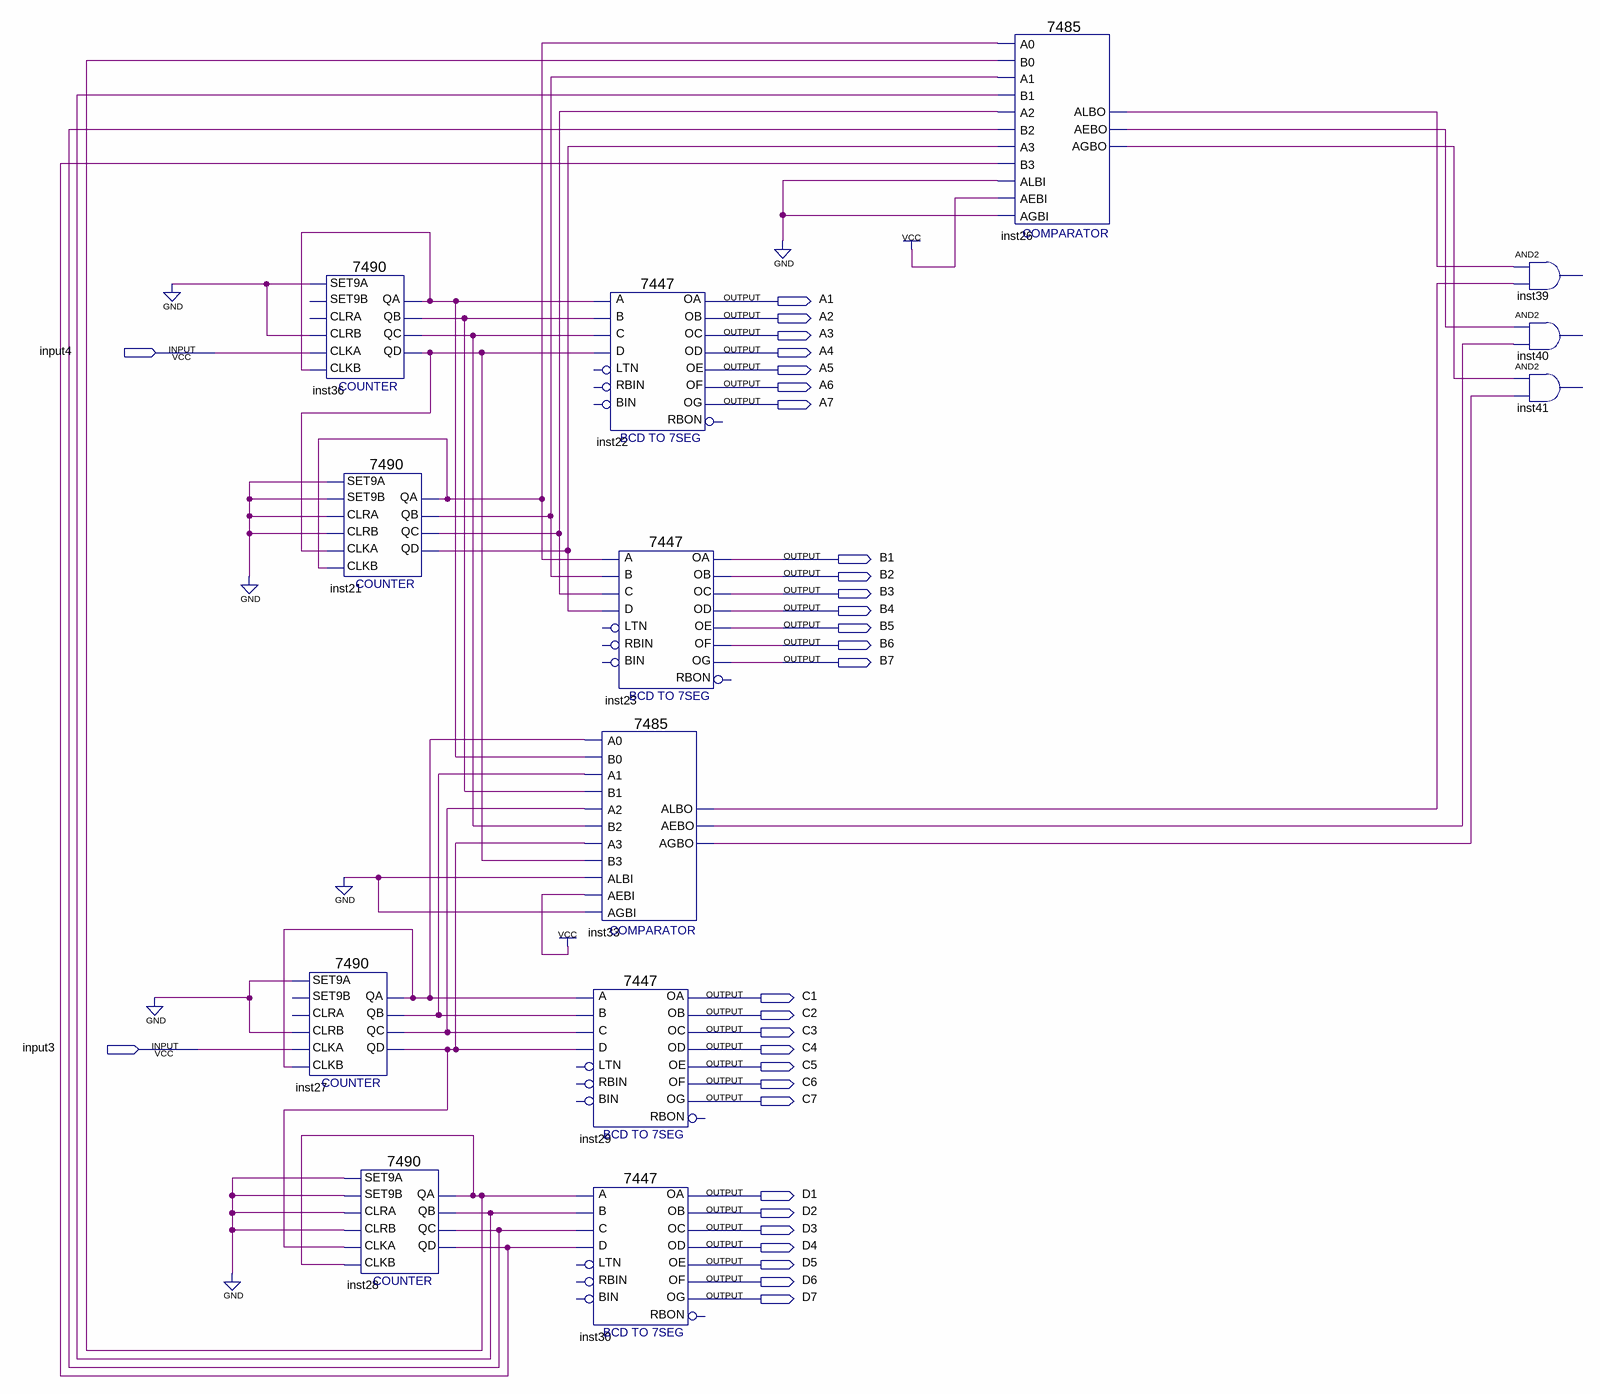
[diagram p0: schematic sheet]
// Quartus schematic prueba2.bdf as structural Verilog: 13 symbols, 30 pins
module prueba2 (
  input  input4,
  input  input3,
  output A1,
  output A2,
  output A3,
  output A4,
  output A5,
  output A6,
  output A7,
  output B1,
  output B2,
  output B3,
  output B4,
  output B5,
  output B6,
  output B7,
  output C1,
  output C2,
  output C3,
  output C4,
  output C5,
  output C6,
  output C7,
  output D1,
  output D2,
  output D3,
  output D4,
  output D5,
  output D6,
  output D7
);

  wire inst21_qa, inst21_qb, inst21_qc, inst21_qd, inst26_aebo, inst26_agbo, inst26_albo, inst27_qa,
       inst27_qb, inst27_qc, inst27_qd, inst28_qa, inst28_qb, inst28_qc, inst28_qd, inst33_aebo, inst33_agbo,
       inst33_albo, inst36_qa, inst36_qb, inst36_qc, inst36_qd;

  \7490  inst27 (
    .SET9A(1'b0), .CLKB(inst27_qa), .CLKA(input3), .CLRB(1'b0), .QD(inst27_qd), .QA(inst27_qa),
    .QB(inst27_qb), .QC(inst27_qc));  // open: CLRA, SET9B
  \7490  inst36 (
    .SET9A(1'b0), .CLKB(inst36_qa), .CLKA(input4), .CLRB(1'b0), .QD(inst36_qd), .QA(inst36_qa),
    .QB(inst36_qb), .QC(inst36_qc));  // open: CLRA, SET9B
  \7490  inst21 (
    .SET9A(1'b0), .CLRA(1'b0), .SET9B(1'b0), .CLKB(inst21_qa), .CLKA(inst36_qd), .CLRB(1'b0), .QD(inst21_qd),
    .QA(inst21_qa), .QB(inst21_qb), .QC(inst21_qc));
  \7490  inst28 (
    .SET9A(1'b0), .CLRA(1'b0), .SET9B(1'b0), .CLKB(inst28_qa), .CLKA(inst27_qd), .CLRB(1'b0), .QD(inst28_qd),
    .QA(inst28_qa), .QB(inst28_qb), .QC(inst28_qc));
  \7447  inst29 (
    .B(inst27_qb), .C(inst27_qc), .D(inst27_qd), .A(inst27_qa), .OB(C2), .OC(C3), .OE(C5), .OD(C4), .OF(C6),
    .OG(C7), .OA(C1));  // open: LTN, RBIN, BIN, RBON
  \7447  inst30 (
    .B(inst28_qb), .C(inst28_qc), .D(inst28_qd), .A(inst28_qa), .OB(D2), .OC(D3), .OE(D5), .OD(D4), .OF(D6),
    .OG(D7), .OA(D1));  // open: LTN, RBIN, BIN, RBON
  \7447  inst22 (
    .B(inst36_qb), .C(inst36_qc), .D(inst36_qd), .A(inst36_qa), .OB(A2), .OC(A3), .OE(A5), .OD(A4), .OF(A6),
    .OG(A7), .OA(A1));  // open: LTN, RBIN, BIN, RBON
  \7447  inst23 (
    .B(inst21_qb), .C(inst21_qc), .D(inst21_qd), .A(inst21_qa), .OB(B2), .OC(B3), .OE(B5), .OD(B4), .OF(B6),
    .OG(B7), .OA(B1));  // open: LTN, RBIN, BIN, RBON
  \7485  inst33 (
    .A3(inst27_qd), .B2(inst36_qc), .A2(inst27_qc), .AEBI(1'b1), .AGBI(1'b0), .ALBI(1'b0), .A0(inst27_qa),
    .B0(inst36_qa), .B3(inst36_qd), .A1(inst27_qb), .B1(inst36_qb), .ALBO(inst33_albo), .AGBO(inst33_agbo),
    .AEBO(inst33_aebo));
  \7485  inst26 (
    .A3(inst21_qd), .B2(inst28_qc), .A2(inst21_qc), .AEBI(1'b1), .AGBI(1'b0), .ALBI(1'b0), .A0(inst21_qa),
    .B0(inst28_qa), .B3(inst28_qd), .A1(inst21_qb), .B1(inst28_qb), .ALBO(inst26_albo), .AGBO(inst26_agbo),
    .AEBO(inst26_aebo));
  // AND2 inst39 has open pins: IN1=inst26_albo, IN2=inst33_albo, OUT=open
  // AND2 inst40 has open pins: IN1=inst26_aebo, IN2=inst33_aebo, OUT=open
  // AND2 inst41 has open pins: IN1=inst26_agbo, IN2=inst33_agbo, OUT=open
endmodule
